# Altium schematic sheet Debug.SchDoc
size A; SheetNumber: 10; SheetTotal: 14
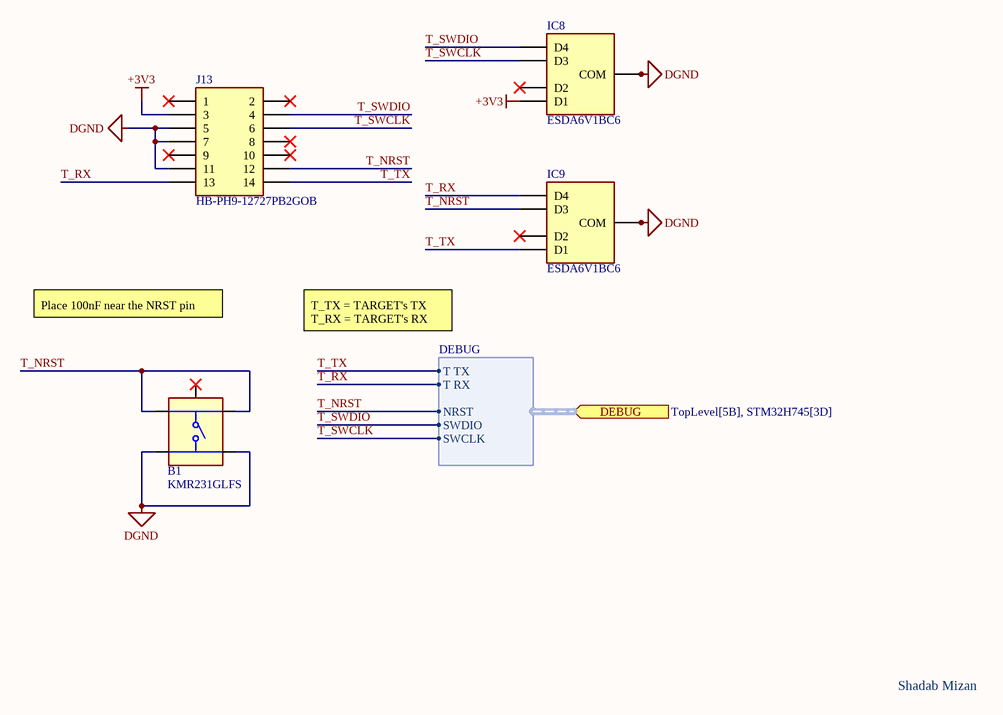
[diagram p0: Debug.SchDoc]

## Parts
B1  KMR231GLFS  [KMR231GLFS]
IC8  ESDA6V1BC6  [SOT95P280X145-6N]
IC9  ESDA6V1BC6  [SOT95P280X145-6N]
J13  HB-PH9-12727PB2GOB  [HB-PH9-12727PB2GOB]

## Ports
DEBUG (in, harness DEBUG, see TopLevel[5B], STM32H745[3D])

## Harnesses
DEBUG: T TX, T RX, NRST, SWDIO, SWCLK

## Nets
+3V3: IC8.1(D1) J13.3
DGND: B1.3 B1.4 IC8.2(COM) IC8.5(COM) IC9.2(COM) IC9.5(COM) J13.5 J13.7 J13.11
T_NRST: B1.1 B1.2 IC9.4(D3) J13.12 ; port DEBUG.NRST
T_RX: IC9.6(D4) J13.13 ; port DEBUG.T RX
T_SWCLK: IC8.4(D3) J13.6 ; port DEBUG.SWCLK
T_SWDIO: IC8.6(D4) J13.4 ; port DEBUG.SWDIO
T_TX: IC9.1(D1) J13.14 ; port DEBUG.T TX

Not connected (* = marked no-connect by the designer): B1 5*; IC8 3(D2)*; IC9 3(D2)*; J13 1* 2* 8* 9* 10*

## Notes on the sheet
- Place 100nF near the NRST pin
- T_TX = TARGET's TX
  T_RX = TARGET's RX
- Shadab Mizan

## Library data of the parts
B1 = KMR231GLFS: Tactile Switch SPST 300gf 1.9mm Gull Wing 4.6mm x 2.8mm Surface Mount; LCSC Part #: C99271; Manu Part #: KMR231GLFS
IC8 IC9 = ESDA6V1BC6: Clamp Ipp Tvs Diode Surface Mount SOT-23-6; LCSC Part #: C495220; Manu Part #: ESDA6V1BC6
J13 = HB-PH9-12727PB2GOB: Pin Header 2 1mm 4mm 14P -40℃~+105℃ 1.27mm 1A 250V 2x7P 1.27mm SMD,P=1.27mm Headers, Male Pins RoHS; LCSC Part #: C6332251; Manu Part #: HB-PH9-12727PB2GOB